# EAGLE design LEDDimmerI2C (EAGLE 6.4)
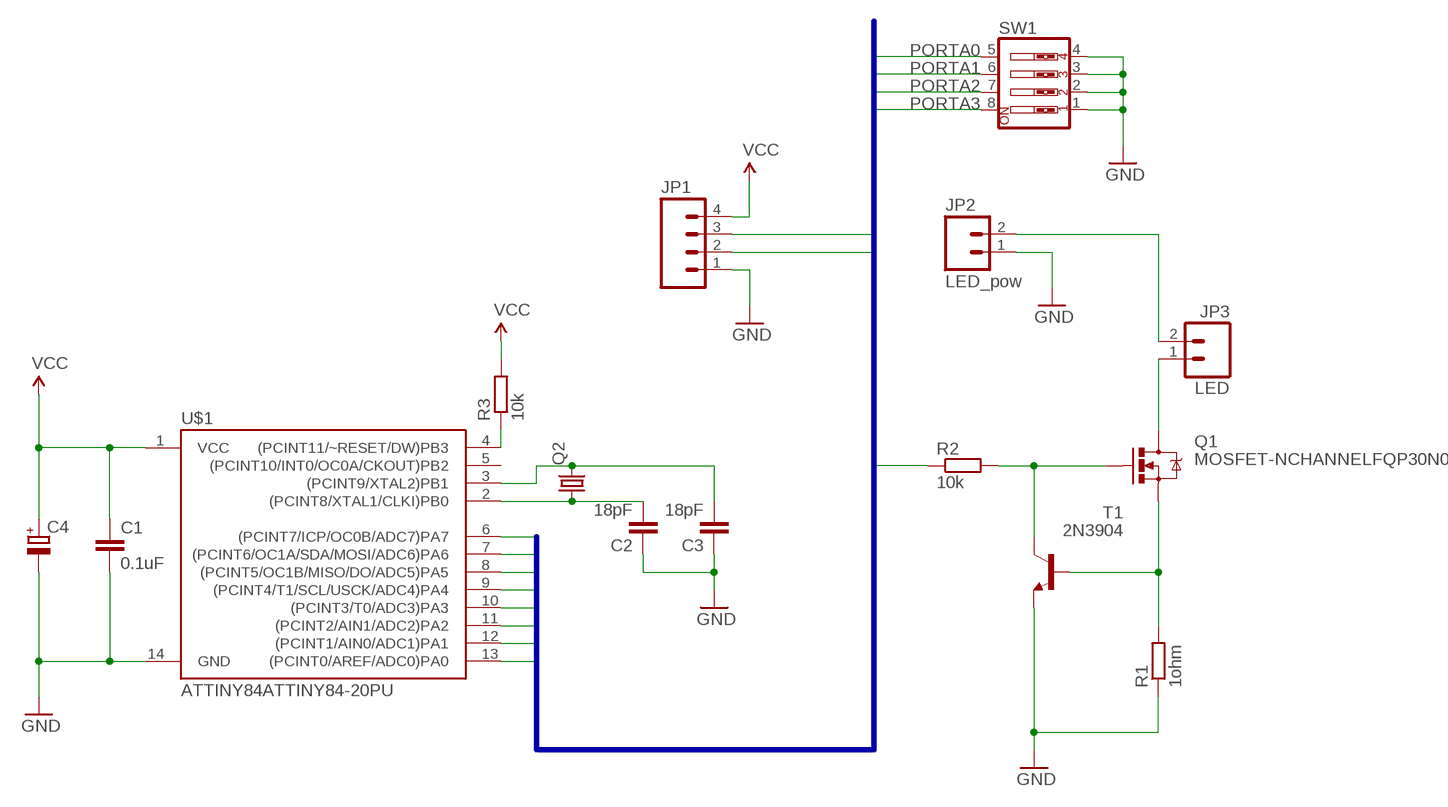
[diagram p0: schematic, sheet 1]

## Parts
C1  0.1uF  CAP0805  [0805]
C2  18pF  CAP0805  [0805]
C3  18pF  CAP0805  [0805]
C4  CPOL-EUE3.5-10  [E3,5-10]
JP1  M04LONGPADS  [1X04_LONGPADS]
JP2  LED_pow  M02PTH3  [1X02_LONGPADS]
JP3  LED  M02PTH3  [1X02_LONGPADS]
Q1  MOSFET-NCHANNELFQP30N06L  [TO220V]
Q2  CRYSTALSM49  [SM49]
R1  1ohm  R-EU_VMTB60  [VMTB60]
R2  10k  R-EU_R0805  [R0805]
R3  10k  R-EU_R0805  [R0805]
SW1  SW_DIP-4  [EDG-04]
T1  2N3904  [TO92]
U$1  ATTINY84ATTINY84-20PU  [DIL14]

## Nets
GND: C1.2 C2.1 C3.1 C4.- JP1.1 JP2.1 R1.1 SW1.1 SW1.2 SW1.3 SW1.4 T1.3(E) U$1.14(GND)
N$1: Q1.1(G) R2.2 T1.1(C)
N$2: R3.1 U$1.4((PCINT11/~RESET/DW)PB3)
N$3: C3.2 Q2.2 U$1.3((PCINT9/XTAL2)PB1)
N$4: C2.2 Q2.1 U$1.2((PCINT8/XTAL1/CLKI)PB0)
N$5: Q1.3(S) R1.2 T1.2(B)
N$6: JP2.2 JP3.2
N$8: JP3.1 Q1.2(D)
PORTA0: SW1.5 U$1.13((PCINT0/AREF/ADC0)PA0)
PORTA1: SW1.6 U$1.12((PCINT1/AIN0/ADC1)PA1)
PORTA2: SW1.7 U$1.11((PCINT2/AIN1/ADC2)PA2)
PORTA3: SW1.8 U$1.10((PCINT3/T0/ADC3)PA3)
PORTA4: JP1.2 U$1.9((PCINT4/T1/SCL/USCK/ADC4)PA4)
PORTA5: R2.1 U$1.8((PCINT5/OC1B/MISO/DO/ADC5)PA5)
PORTA6: JP1.3 U$1.7((PCINT6/OC1A/SDA/MOSI/ADC6)PA6)
PORTA7: U$1.6((PCINT7/ICP/OC0B/ADC7)PA7)
VCC: C1.1 C4.+ JP1.4 R3.2 U$1.1(VCC)
Unconnected: U$1.5((PCINT10/INT0/OC0A/CKOUT)PB2)

## Buses
PORTA[0..7]

## Library data of the parts
C1-C3 = SparkFun-Capacitors:CAP: Capacitor Standard 0603 ceramic capacitor, and 0.1" leaded capacitor.
C4 = rcl:CPOL-EU: POLARIZED CAPACITOR, European symbol
JP1 = SparkFun-Connectors:M04: Header 4 Standard 4-pin 0.1" header. Use with straight break away headers (SKU : PRT-00116), right angle break away headers (PRT-00553), swiss pins (PRT-00743), machine pins (PRT-00117), and female headers (PRT-00115). Molex polarized connector foot print use with SKU : PRT-08231 with associated crimp pins and housings. 1MM SMD Version SKU: PRT-10208
JP2 JP3 = SparkFun-Connectors:M02: Standard 2-pin 0.1" header. Use with - straight break away headers ( PRT-00116) - right angle break away headers (PRT-00553) - swiss pins (PRT-00743) - machine pins (PRT-00117) - female headers (PRT-00115) Molex polarized connector foot print use with: PRT-08233 with associated crimp pins and housings. 2.54_SCREWTERM for use with PRT-10571. 3.5mm Screw Terminal footprints for PRT-08084 5mm Screw Terminal footprints for use with PRT-08433
Q1 = SparkFun-DiscreteSemi:MOSFET-NCHANNEL: Common NMOSFET Parts MFG P/N Store ID Prod ID FDD8780 TRANS-09984 SI7820DN TRANS-11055 FDS6630A IC-08089 2N7002PW TRANS-11151 FQP30N06L COM-10213 TRANS-10060 BSS123LT1G TRANS-08345 BSS138 TRANS-00830 BS170 2N7000; PROD_ID: TRANS-10060
Q2 = adafruit:CRYSTAL: CRYSTAL; OC_FARNELL: unknown; OC_NEWARK: unknown
R1-R3 = rcl:R-EU_: RESISTOR, European symbol
SW1 = special:SW_DIP-4: DIP SWITCH
T1 = transistor:2N3904: NPN TRANSISTOR
U$1 = SparkFun-DigitalIC:ATTINY84: Atmel 14-pin 2/4/8kB flash uC

## Net classes
0 default: width 0.762 mm, clearance 0.762 mm

## Board
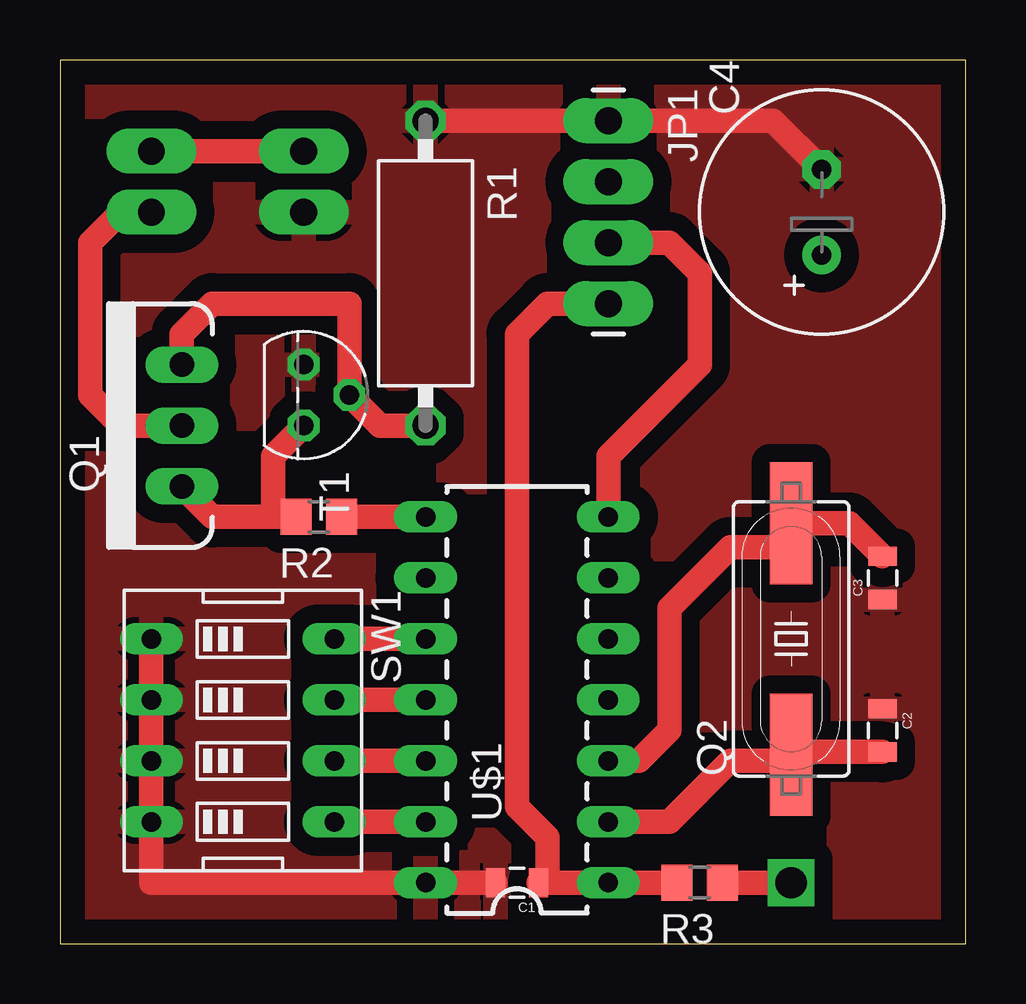
[diagram p1: board, top side]
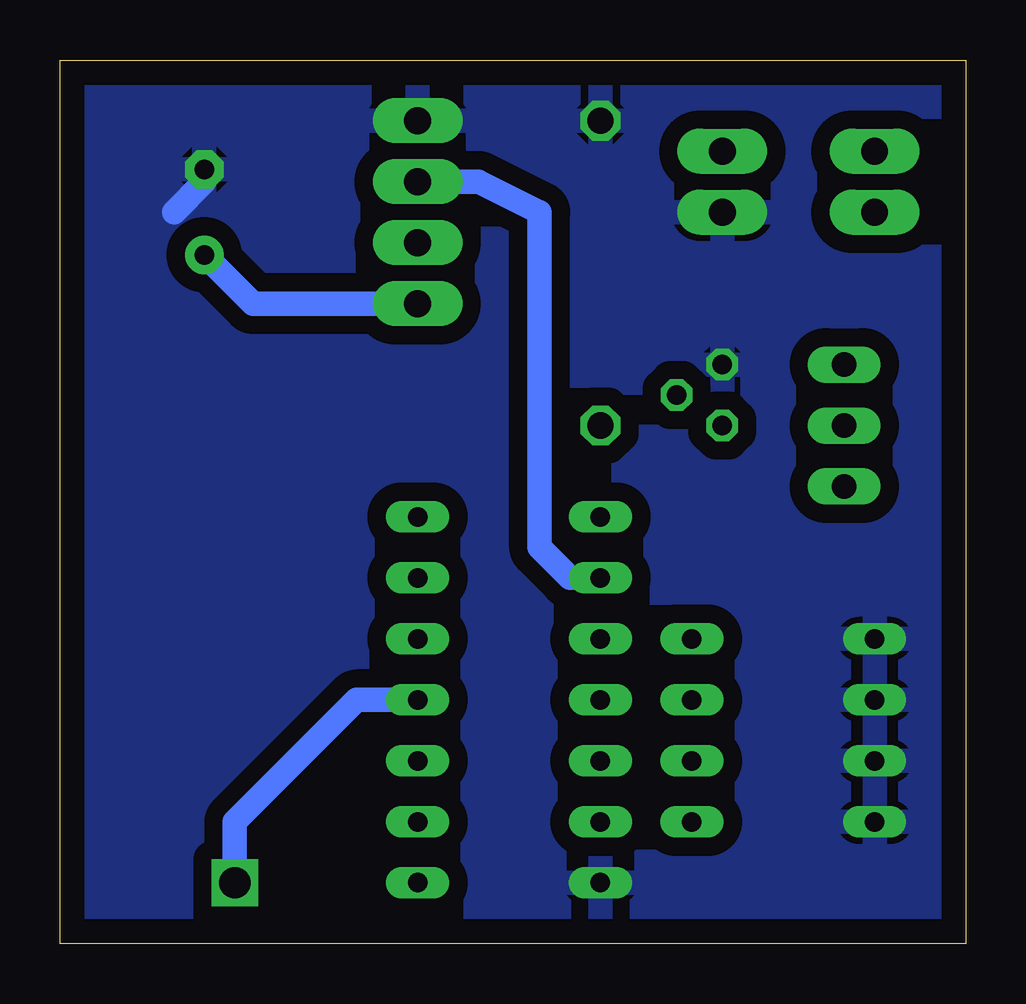
[diagram p2: board, bottom side, seen from below]

Size 37.77 x 36.82 mm. Coordinates in mm from the lower left corner, seen from the top.
Outline: 0,0 37.77,0 37.77,36.82 0,36.82 0,0
Copper layers (1*16): Top 0.035mm / dielectric 1.5mm / Bottom 0.035mm
Design rules "default": minimum track width 10mil, minimum drill 24mil, track to track 8mil, track to pad 8mil, pad to pad 8mil, via to via 8mil, smd to smd 8mil, copper to edge 40mil, drill to drill 8mil, minimum pad ring 10mil, minimum via ring 8mil, stop-mask expansion 4mil, vias tented up to drill 0mil, thermal gap 10mil

### Footprints (pad centres in the part's own frame; a part is rotated, then mirrored left to right if it is on the bottom)
0805 = smd 0.8 x 1.2: 1 -0.9,0; 2 0.9,0
E3,5-10 = drill 0.813 pad 1.6: + -1.778,0 | drill 0.813 pad 1.6 octagon: - 1.778,0
1X04_LONGPADS = drill 1.118 pad 1.88 long: 1 0,0; 2 2.54,0; 3 5.08,0; 4 7.62,0
1X02_LONGPADS = drill 1.118 pad 1.88 long: 1 0,0; 2 2.54,0
TO220V = drill 1.016 long: 1 -2.54,0; 2 0,0; 3 2.54,0
SM49 = smd 5.08 x 1.778: 1 -4.826,0; 2 4.826,0
VMTB60 = drill 1.1 octagon: 1 -6.35,0; 2 6.35,0
R0805 = smd 1.3 x 1.5: 1 -0.95,0; 2 0.95,0
EDG-04 = drill 0.813 long: 1 -3.81,-3.81; 2 -1.27,-3.81; 3 1.27,-3.81; 4 3.81,-3.81; 5 3.81,3.81; 6 1.27,3.81; 7 -1.27,3.81; 8 -3.81,3.81
TO92 = drill 0.813 octagon: 1 1.27,0; 2 0,1.905; 3 -1.27,0
DIL14 = drill 0.813 long: 1 -8.89,-3.81; 2 -6.35,-3.81; 3 -3.81,-3.81; 4 -1.27,-3.81; 5 1.27,-3.81; 6 3.81,-3.81; 7 6.35,-3.81; 8 6.35,3.81; 9 3.81,3.81; 10 1.27,3.81; 11 -1.27,3.81; 12 -3.81,3.81; 13 -6.35,3.81; 14 -8.89,3.81

### Placement (x,y rotation side)
C1  19.05,2.54 180 top
C2  34.29,8.89 270 top
C3  34.29,15.24 90 top
C4  31.75,30.48 90 top
JP1  22.86,34.29 270 top
JP2  10.16,30.48 90 top
JP3  3.81,30.48 90 top
Q1  5.08,21.59 90 top
Q2  30.48,12.7 90 top
R1  15.24,27.94 270 top
R2  10.79,17.78 180 top
R3  26.67,2.54 180 top
SW1  7.62,8.89 270 top
T1  10.16,22.86 270 top
U$1  19.05,11.43 90 top

### Tracks (layer width: path | path; a pad name or v marks a point on that pad's centre or on a via)
GND
  Top 1.016: R1.1 JP1.1 29.72,34.29 C4.- | C1.2 U$1.14 3.81,2.54 SW1.4 SW1.3 SW1.2 SW1.1
  Bottom 1.016: C4.- 31.75,31.75 33.02,30.48
  pour Bottom: 0,36.83 38.1,36.83 38.1,0 0,0
  pour Top: 0,36.83 38.1,36.83 38.1,35.56 38.1,0 0,0
N$1
  Top 1.016: R2.2 8.89,17.78 | 8.89,17.78 6.35,17.78 Q1.1 | T1.1 8.89,20.32 8.89,17.78
N$2  (via drill 1.3)
  Top 1.016: v30.48,2.54 R3.1
  Bottom 1.016: U$1.4 25.4,10.16 30.48,5.08 v30.48,2.54
N$3
  Top 1.016: U$1.3 24.13,7.62 25.4,8.89 25.4,13.97 27.94,16.51 30.48,16.51 Q2.2 32.9,17.53 C3.2
N$4
  Top 1.016: U$1.2 25.4,5.08 27.94,7.62 30.23,7.62 Q2.1 30.6,7.99 C2.2
N$5
  Top 1.016: R1.2 13.34,21.59 T1.2 12.06,26.67 6.35,26.67 5.08,25.4 Q1.3
N$6
  Top 1.016: JP3.2 JP2.2
N$8
  Top 1.016: Q1.2 2.54,21.59 1.27,22.86 1.27,29.21 2.54,30.48 JP3.1
PORTA0
  Top 1.016: U$1.13 SW1.5
PORTA1
  Top 1.016: U$1.12 SW1.6
PORTA2
  Top 1.016: U$1.11 SW1.7
PORTA3
  Top 1.016: U$1.10 SW1.8
PORTA4
  Bottom 1.016: U$1.9 16.51,15.24 17.78,16.51 17.78,30.48 20.32,31.75 JP1.2
PORTA5
  Top 1.016: U$1.8 R2.1
PORTA6
  Top 1.016: U$1.7 22.86,20.32 26.67,24.13 26.67,27.94 25.4,29.21 JP1.3
VCC
  Top 1.016: R3.2 U$1.1 C1.1 20.32,2.91 20.32,4.45 19.05,5.71 19.05,25.4 20.32,26.67 JP1.4
  Bottom 1.016: JP1.4 29.72,26.67 C4.+